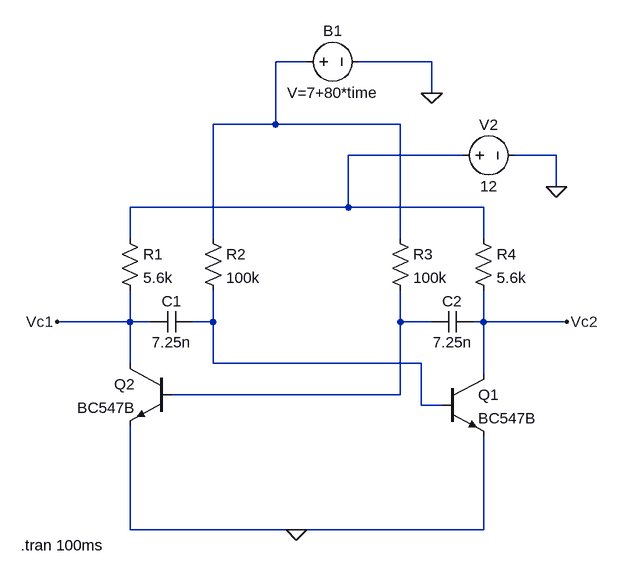
[diagram p0: schematic Vco-1.asc]
Vco-1.asc, the LTspice schematic file:
Version 4
SHEET 1 940 680
WIRE 480 -432 432 -432
WIRE 672 -432 560 -432
WIRE 672 -384 672 -432
WIRE 432 -336 432 -432
WIRE 432 -336 336 -336
WIRE 624 -336 432 -336
WIRE 720 -288 544 -288
WIRE 864 -288 800 -288
WIRE 864 -240 864 -288
WIRE 544 -208 544 -288
WIRE 544 -208 208 -208
WIRE 752 -208 544 -208
WIRE 208 -160 208 -208
WIRE 336 -160 336 -336
WIRE 624 -160 624 -336
WIRE 752 -160 752 -208
WIRE 208 -32 208 -80
WIRE 208 -32 96 -32
WIRE 240 -32 208 -32
WIRE 336 -32 336 -80
WIRE 336 -32 304 -32
WIRE 624 -32 624 -80
WIRE 672 -32 624 -32
WIRE 752 -32 752 -80
WIRE 752 -32 736 -32
WIRE 880 -32 752 -32
WIRE 208 32 208 -32
WIRE 336 32 336 -32
WIRE 656 32 336 32
WIRE 752 48 752 -32
WIRE 624 80 624 -32
WIRE 624 80 272 80
WIRE 656 96 656 32
WIRE 688 96 656 96
WIRE 208 288 208 128
WIRE 464 288 208 288
WIRE 752 288 752 144
WIRE 752 288 464 288
FLAG 464 288 0
FLAG 96 -32 Vc1
FLAG 880 -32 Vc2
FLAG 672 -384 0
FLAG 864 -240 0
SYMBOL res 192 -176 R0
SYMATTR InstName R1
SYMATTR Value 5.6k
SYMBOL res 320 -176 R0
SYMATTR InstName R2
SYMATTR Value 100k
SYMBOL res 608 -176 R0
SYMATTR InstName R3
SYMATTR Value 100k
SYMBOL cap 304 -48 R90
WINDOW 0 0 32 VBottom 2
WINDOW 3 32 32 VTop 2
SYMATTR InstName C1
SYMATTR Value 7.25n
SYMBOL res 736 -176 R0
SYMATTR InstName R4
SYMATTR Value 5.6k
SYMBOL cap 736 -48 R90
WINDOW 0 0 32 VBottom 2
WINDOW 3 32 32 VTop 2
SYMATTR InstName C2
SYMATTR Value 7.25n
SYMBOL npn 688 48 R0
SYMATTR InstName Q1
SYMATTR Value BC547B
SYMBOL npn 272 32 M0
SYMATTR InstName Q2
SYMATTR Value BC547B
SYMBOL voltage 704 -288 R270
WINDOW 0 32 56 VTop 2
WINDOW 3 -32 56 VBottom 2
WINDOW 123 0 0 Left 0
WINDOW 39 0 0 Left 0
SYMATTR InstName V2
SYMATTR Value 12
SYMBOL voltage 464 -432 R270
WINDOW 0 32 56 VTop 2
WINDOW 3 -32 56 VBottom 2
SYMATTR InstName B1
SYMATTR Value V=7+80*time
SYMATTR Prefix B
TEXT 40 312 Left 2 !.tran 100ms

The netlist it stands for:
* Vco-1.asc
R1 N002 Vc1 5.6k
R2 N001 N003 100k
R3 N001 N004 100k
C1 N003 Vc1 7.25n
R4 N002 Vc2 5.6k
C2 Vc2 N004 7.25n
Q1 Vc2 N003 0 0 BC547B
Q2 Vc1 N004 0 0 BC547B
V2 N002 0 12
B1 N001 0 V=7+80*time
.model NPN NPN
.model PNP PNP
.lib standard.bjt
.tran 100ms
.backanno
.end